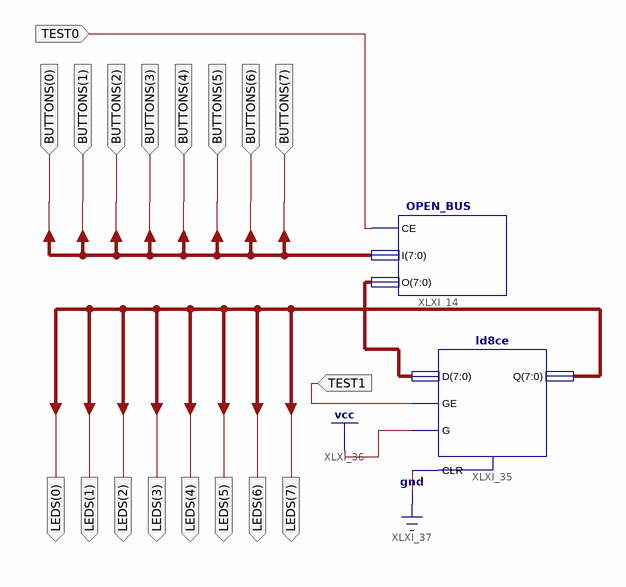
[diagram p0: schematic sheet 1]
// Xilinx ISE schematic io_test.sch (spartan3) as structural Verilog: 2 symbols, 18 ports
module io_test (
  input  [7:0] BUTTONS,
  input  TEST0,
  input  TEST1,
  output [7:0] LEDS
);

  wire [7:0] XLXN_80;

  OPEN_BUS XLXI_14 (.CE(TEST0), .I(BUTTONS), .O(XLXN_80));
  ld8ce XLXI_35 (.CLR(1'b0), .D(XLXN_80), .G(1'b1), .GE(TEST1), .Q(LEDS));
endmodule
